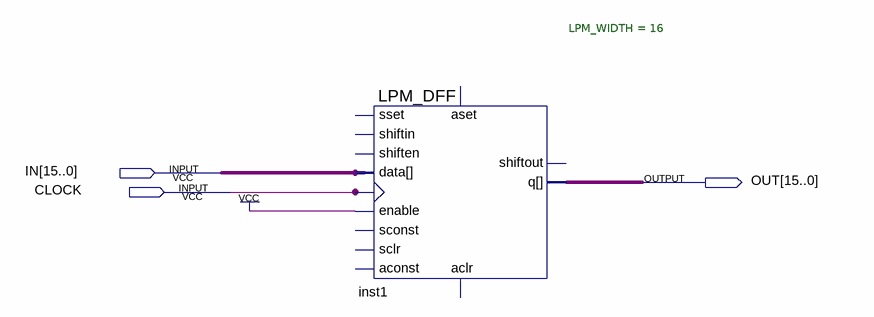
[diagram p0: schematic sheet]
// Quartus schematic PIPE16.bdf as structural Verilog: 1 symbols, 3 pins
module PIPE16 (
  input  [15:0] IN,
  input  CLOCK,
  output [15:0] OUT
);

  LPM_DFF #(.LPM_WIDTH(16)) inst1 (
    .enable(1'b1), .clock(CLOCK), .data(IN), .q(OUT));  // open: shiftin, shiften, aconst, sclr, sconst, sset, aset, aclr, shiftout
endmodule
